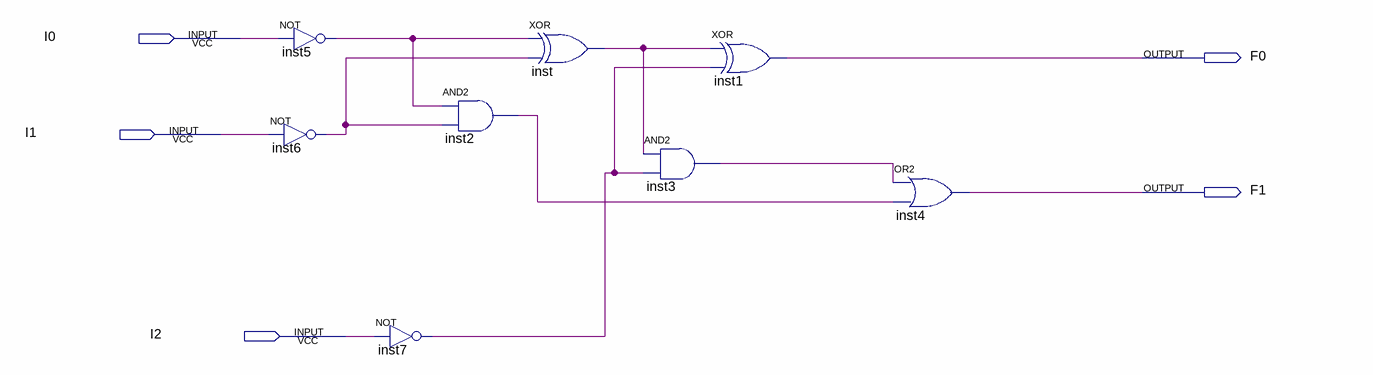
[diagram p0: schematic sheet]
// Quartus schematic FullAdder.bdf as structural Verilog: 8 symbols, 5 pins
module FullAdder (
  input  I0,
  input  I1,
  input  I2,
  output F0,
  output F1
);

  wire inst2_out, inst3_out, inst5_out, inst6_out, inst7_out, inst_out;

  not inst5 (inst5_out, I0);
  not inst6 (inst6_out, I1);
  and inst2 (inst2_out, inst5_out, inst6_out);
  not inst7 (inst7_out, I2);
  xor inst (inst_out, inst5_out, inst6_out);
  and inst3 (inst3_out, inst_out, inst7_out);
  xor inst1 (F0, inst_out, inst7_out);
  or inst4 (F1, inst3_out, inst2_out);
endmodule
